# EAGLE design digAudio-rcj-tg10da1nslf (EAGLE 9.6.2)
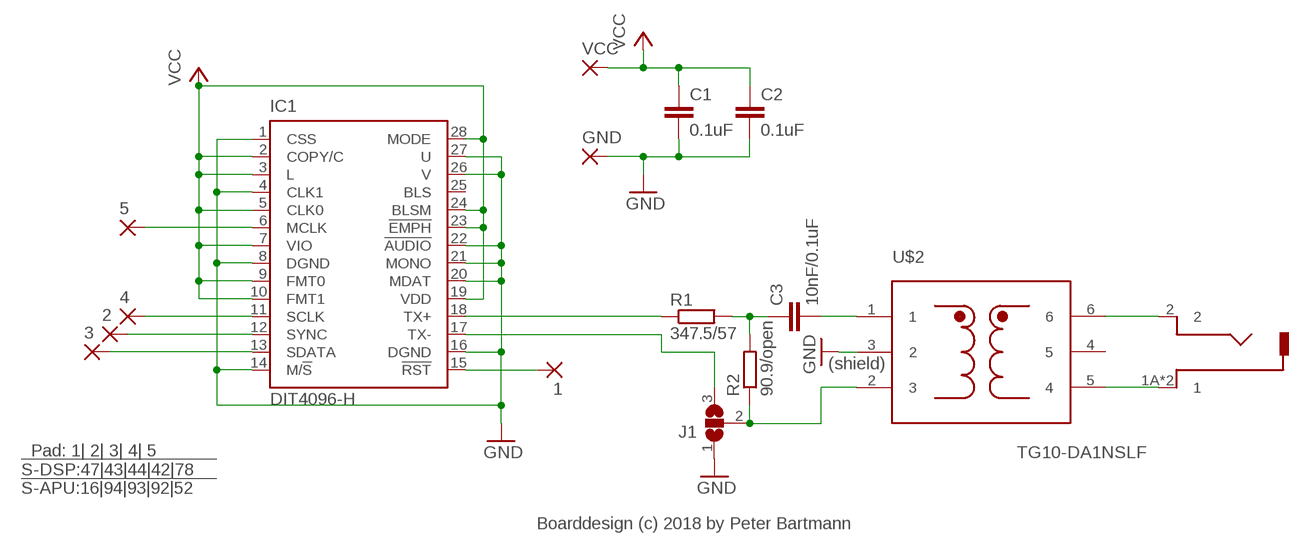
[diagram p0: schematic, sheet 1]

## Parts
1  SMD1  [SMD0,8-1,6]
2  SMD1  [SMD0,8-1,6]
3  SMD1  [SMD0,8-1,6]
4  SMD1  [SMD0,8-1,6]
5  SMD1  [SMD0,8-1,6]
C1  0.1uF  C-EUC0603  [C0603]
C2  0.1uF  C-EUC0603  [C0603]
C3  10nF/0.1uF  C-EUC0603  [C0603]
GND  1,6/0,9  [1,6/0,9]
IC1  DIT4096-H  DIT4192-H  [PW_R-PDSO-G28]
J1  SJ2W  [SJ_2]
R1  347.5/57  R-EU_R0603  [R0603]
R2  90.9/open  R-EU_R0603  [R0603]
U$1  RCJ-013-SMT-TR  RCJ_01X_SMT-MODIFIED  [RCJ_01X_SMT_MODIFIED]
U$2  TG10-DA1NSLF  [TG10-DA1NSFL]
VCC  1,6/0,9  [1,6/0,9]

## Nets
GND: C1.2 C2.2 GND.1(P) IC1.1(CSS) IC1.4(CLK1) IC1.8(DGND) IC1.14(M/!S) IC1.16(DGND) IC1.20(MDAT) IC1.21(MONO) IC1.22(!AUDIO) IC1.26(V) IC1.27(U) J1.1 U$2.3
N$1: IC1.18(TX+) R1.1
N$2: 1.P$1(P) IC1.15(!RST)
N$3: 2.P$1(P) IC1.12(SYNC)
N$4: 4.P$1(P) IC1.11(SCLK)
N$5: 3.P$1(P) IC1.13(SDATA)
N$6: 5.P$1(P) IC1.6(MCLK)
N$7: IC1.17(TX-) J1.3
N$8: C3.1 R1.2 R2.2
N$9: U$1.2 U$2.6
N$10: U$1.1A U$1.1B U$2.5
N$11: C3.2 U$2.1
N$12: J1.2 R2.1 U$2.2
VCC: C1.1 C2.1 IC1.2(COPY/C) IC1.3(L) IC1.5(CLK0) IC1.7(VIO) IC1.9(FMT0) IC1.10(FMT1) IC1.19(VDD) IC1.23(!EMPH) IC1.24(BLSM) IC1.28(MODE) VCC.1(P)
Unconnected: IC1.25(BLS) U$2.4

## Notes on the sheet
- (shield)
- Pad: 1| 2| 3| 4| 5
  S-DSP:47|43|44|42|78
  S-APU:16|94|93|92|52
- Boarddesign (c) 2018 by Peter Bartmann

## Library data of the parts
1-5 = wirepad:SMD1
C1-C3 = rcl:C-EU: CAPACITOR, European symbol
GND VCC = wirepad:1,6/0,9: THROUGH-HOLE PAD
IC1 = texas:DIT4192-H: 192kHz Digital Audio Transmitter Hardware Mode Source: http://focus.ti.com/lit/ds/symlink/dit4192.pdf; MF: TEXAS INSTRUMENTS; MPN: DIT4192IPW; OC_FARNELL: 7455057; OC_NEWARK: 74C9511
J1 = jumper:SJ2W: SMD solder JUMPER
R1 R2 = rcl:R-EU_: RESISTOR, European symbol
U$1 = digAudio_SNES:RCJ_01X_SMT
U$2 = cs8406:TG10-DA1NSLF

## Board
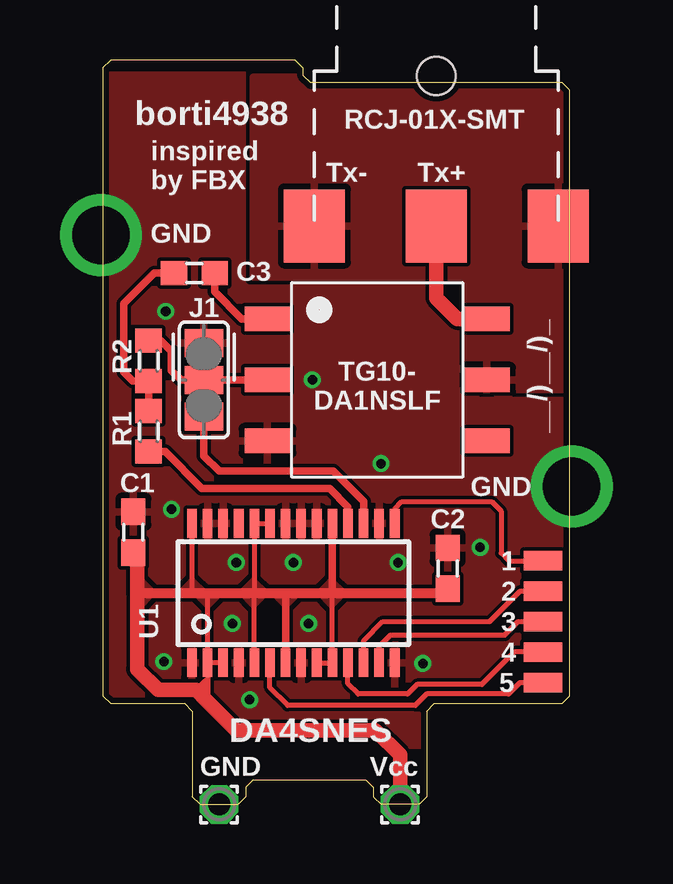
[diagram p1: board, top side]
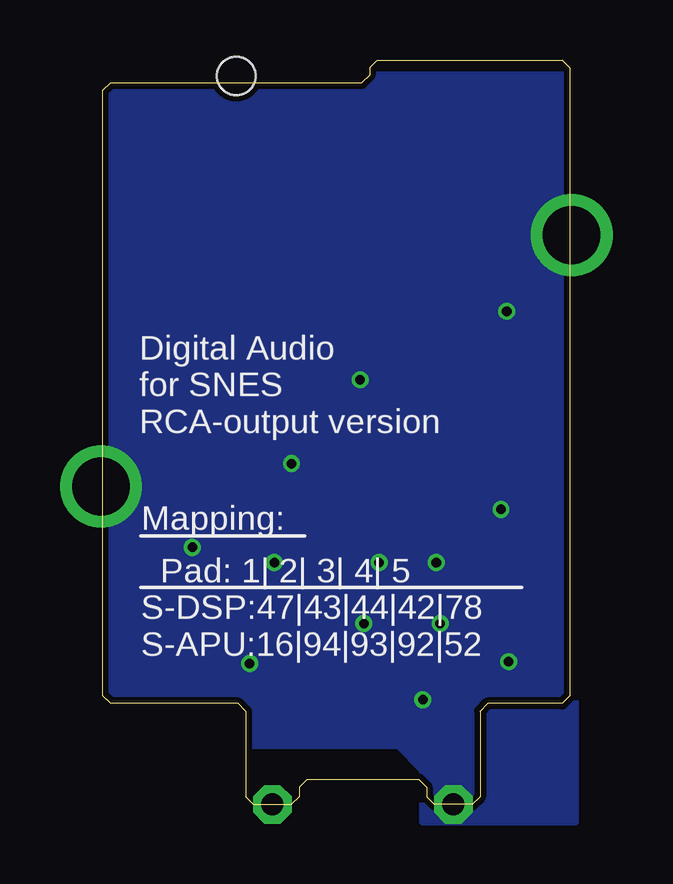
[diagram p2: board, bottom side, seen from below]

Size 19.45 x 31.04 mm. Coordinates in mm from the lower left corner, seen from the top.
Outline: 0,30.72 0,4.52 0.32,4.21 3.41,4.21 3.73,3.89 3.73,0.32 4.05,0 5.64,0 5.95,0.32 5.95,0.71 6.27,1.03 10.95,1.03 11.27,0.71 11.27,0.32 11.59,0 13.18,0 13.49,0.32 13.49,3.89 13.81,4.21 19.13,4.21 19.45,4.52 19.45,29.77 19.13,30.08 8.65,30.08 8.33,30.4 8.33,30.72 8.02,31.04 0.32,31.04 0,30.72
Copper layers (1*16): Top 0.035mm / dielectric 1.5mm / Bottom 0.035mm
Design rules "Elecrow_2-layer_eagle_rule": minimum track width 6mil, minimum drill 12mil, track to track 6mil, track to pad 6mil, pad to pad 6mil, via to via 6mil, smd to smd 0mil, copper to edge 10mil, drill to drill 10mil, minimum pad ring 10mil, minimum via ring 6mil, stop-mask expansion 2mil, vias tented up to drill 100mil, thermal gap 10mil

### Footprints (pad centres in the part's own frame; a part is rotated, then mirrored left to right if it is on the bottom)
SMD0,8-1,6 = smd 0.8 x 1.6: P$1 0,0
C0603 = smd 1.1 x 1: 1 -0.85,0; 2 0.85,0
1,6/0,9 = drill 0.914 pad 1.6 octagon: 1 0,0
PW_R-PDSO-G28 = smd 0.4 x 1.2: 1 -4.225,-2.9; 2 -3.575,-2.9; 3 -2.925,-2.9; 4 -2.275,-2.9; 5 -1.625,-2.9; 6 -0.975,-2.9; 7 -0.325,-2.9; 8 0.325,-2.9; 9 0.975,-2.9; 10 1.625,-2.9; 11 2.275,-2.9; 12 2.925,-2.9; 13 3.575,-2.9; 14 4.225,-2.9; 15 4.225,2.9; 16 3.575,2.9; 17 2.925,2.9; 18 2.275,2.9; 19 1.625,2.9; 20 0.975,2.9; 21 0.325,2.9; 22 -0.325,2.9; 23 -0.975,2.9; 24 -1.625,2.9; 25 -2.275,2.9; 26 -2.925,2.9; 27 -3.575,2.9; 28 -4.225,2.9
SJ_2 = smd 1.168 x 1.6: 1 -1.524,0; 2 0,0; 3 1.524,0
R0603 = smd 1 x 1.1: 1 -0.85,0; 2 0.85,0
RCJ_01X_SMT_MODIFIED = smd 3.048 x 2.54: 1A 0.254,-5.08; 1B 0.254,5.08; 2 0.254,0 | hole 1.6: -6,0
TG10-DA1NSFL = smd 1.905 x 1.016: 1 -4.572,2.54; 2 -4.572,0; 3 -4.572,-2.54; 4 4.572,-2.54; 5 4.572,0; 6 4.572,2.54

### Placement (x,y rotation side)
1  18.34,10.16 90 top
2  18.34,8.89 90 top
3  18.34,7.62 90 top
4  18.34,6.35 90 top
5  18.34,5.08 90 top
C1  1.27,11.35 90 top
C2  14.37,9.84 90 top
C3  3.81,22.15 0 top
GND  4.84,0 0 top
IC1  7.94,8.81 0 top
J1  4.21,17.7 270 top
R1  1.91,15.56 90 top
R2  1.91,18.49 270 top
U$1  13.89,24.37 270 top
U$2  11.43,17.7 0 top
VCC  12.38,0 0 top

### Tracks (layer width: path | path; a pad name or v marks a point on that pad's centre or on a via)
GND  (via drill 0.4, 2.4)
  Bottom 0.406: GND.1 4.84,0.56
  other vias: -0.08,23.73 19.53,13.26 5.4,7.54 8.57,7.54 15.72,10.72 12.3,10.08 7.94,10.08 5.56,10.08 2.86,12.3 8.73,17.7 11.59,14.21 2.62,20.56 2.54,5.95 6.11,4.37 13.34,5.87
  pour Top (rank 6): 0.08,30.4 0.08,2.46 19.68,2.46 19.45,30.4
  pour Bottom (no thermals): -0.24,-0.71 6.11,-0.71 6.11,1.43 7.14,2.46 19.45,2.46 19.45,30.4 -0.24,30.4
N$1
  Top 0.305: IC1.18 10.21,12.41 9.45,13.18 4.13,13.18 2.6,14.71 R1.1
N$2
  Top 0.203: IC1.15 12.16,12.32 12.46,12.62 16.19,12.62 16.59,12.22 16.59,10.48 16.91,10.16 1.P$1
N$3
  Top 0.203: IC1.12 10.86,6.81 11.67,7.62 16.11,7.62 17.38,8.89 2.P$1
N$4
  Top 0.203: 4.P$1 17.14,6.35 15.8,5 13.1,5 12.7,4.6 10.64,4.6 10.21,5.03 IC1.11
N$5
  Top 0.203: IC1.13 11.51,6.59 11.99,7.06 16.75,7.06 17.3,7.62 3.P$1
N$6
  Top 0.203: IC1.6 6.96,4.86 7.7,4.13 13.02,4.13 13.49,4.6 16.91,4.6 17.38,5.08 5.P$1
N$7
  Top 0.305: J1.3 4.21,14.53 4.84,13.89 9.6,13.89 10.86,12.63 IC1.17
N$8
  Top 0.305: R1.2 R2.2 1.25,17.64 0.87,18.02 0.87,20.88 2.14,22.15 C3.1
N$9
  Top 0.61: U$1.2 13.89,21.11 14.76,20.24 U$2.6
N$10
  pour Top: 6.27,21.99 15.16,21.99 15.16,17.3 19.45,17.3 19.45,30.4 6.27,30.32
N$11
  Top 0.305: C3.2 4.66,21.37 5.79,20.24 U$2.1
N$12
  Top 0.305: R2.1 2.4,19.34 2.86,18.89 2.86,18.1 3.25,17.7 J1.2 U$2.2
VCC
  Top 0.203: IC1.28 3.71,8.91 3.81,8.81 | IC1.23 IC1.24 6.31,8.85 6.35,8.81 6.31,8.77 IC1.5 | IC1.2 4.36,8.73 4.44,8.81 | IC1.3 IC1.2 | IC1.9 IC1.10 9.56,8.81 9.52,8.81 | IC1.2 4.36,5.24 | 4.36,5.24 4.17,5.04 | 4.17,5.04 3.89,4.77 3.88,4.77 | 4.36,5.24 4.36,4.84 | 4.28,4.36 4.36,4.44 4.36,4.76 4.36,4.84 | 4.17,5.04 4.36,4.84
  Top 0.305: IC1.7 7.61,8.8 7.62,8.81 | IC1.19 9.56,8.85 9.52,8.81
  Top 0.406: 1.43,8.81 3.81,8.81 4.44,8.81 6.35,8.81 7.62,8.81 9.52,8.81 14.11,8.81 C2.1
  Top 0.61: C1.1 1.43,10.34 1.43,8.81 1.43,5.64 2.3,4.77 3.88,4.77 4.28,4.36 5.55,3.1 11.35,3.1 12.38,2.06 VCC.1
  pour Top: 3.73,9.37 3.17,8.81 4.29,8.81
  pour Top: 6.27,9.37 5.71,8.81 6.83,8.81
  pour Top: 9.53,9.37 8.97,8.81 10.08,8.81
  pour Top: 7.62,8.25 8.18,8.81 7.06,8.81
  pour Top: 6.27,8.25 6.83,8.81 5.71,8.81
  pour Top: 4.37,8.25 4.92,8.81 3.81,8.81
  pour Top: 9.53,8.25 10.08,8.81 8.97,8.81
  pour Top: 2.14,8.81 1.43,9.53 1.43,8.1

### Text on the board
tNames: borti4938 | RCJ-01X-SMT | inspired / by FBX | Tx- | Tx+ | GND | C3 | J1 | R2 | TG10- / DA1NSLF | __/)__/)_ | R1 | C1 | GND | C2 | 1 | 2 | U1 | 3 | 4 | 5 | DA4SNES | GND | Vcc
bNames: Digital Audio / for SNES / RCA-output version | Mapping: | Pad: 1| 2| 3| 4| 5 / S-DSP:47|43|44|42|78 / S-APU:16|94|93|92|52